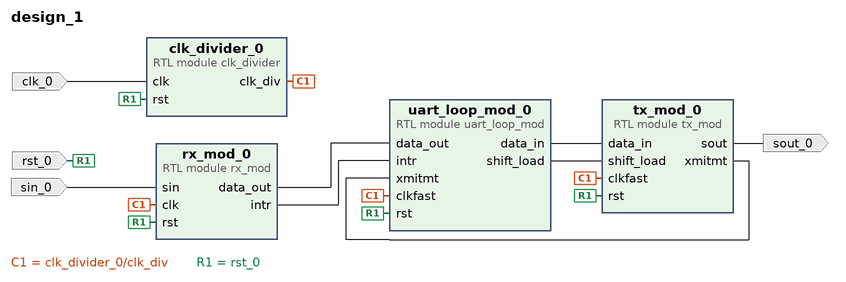
[diagram p0: block diagram of the top level]
# Vivado block design design_1, xc7z020clg400-1, Vivado 2018.3
create_bd_design design_1

create_bd_port -dir I -type rst rst_0
create_bd_port -dir I sin_0
create_bd_port -dir O sout_0
create_bd_port -dir I -type clk clk_0

create_bd_cell -type module -reference clk_divider clk_divider_0
create_bd_cell -type module -reference rx_mod rx_mod_0
create_bd_cell -type module -reference tx_mod tx_mod_0
create_bd_cell -type module -reference uart_loop_mod uart_loop_mod_0

# ---- connections ----

connect_bd_net [get_bd_pins clk_divider_0/clk_div] [get_bd_pins tx_mod_0/clkfast] [get_bd_pins uart_loop_mod_0/clkfast] [get_bd_pins rx_mod_0/clk]
connect_bd_net -net rst_0_1 [get_bd_ports rst_0] \
  [get_bd_pins clk_divider_0/rst] [get_bd_pins rx_mod_0/rst] [get_bd_pins tx_mod_0/rst] [get_bd_pins uart_loop_mod_0/rst]
connect_bd_net -net sin_0_1 [get_bd_ports sin_0] [get_bd_pins rx_mod_0/sin]
connect_bd_net [get_bd_pins tx_mod_0/sout] [get_bd_ports sout_0]
connect_bd_net [get_bd_pins rx_mod_0/data_out] [get_bd_pins uart_loop_mod_0/data_out]
connect_bd_net [get_bd_pins rx_mod_0/intr] [get_bd_pins uart_loop_mod_0/intr]
connect_bd_net [get_bd_pins uart_loop_mod_0/data_in] [get_bd_pins tx_mod_0/data_in]
connect_bd_net [get_bd_pins uart_loop_mod_0/shift_load] [get_bd_pins tx_mod_0/shift_load]
connect_bd_net [get_bd_pins tx_mod_0/xmitmt] [get_bd_pins uart_loop_mod_0/xmitmt]
connect_bd_net -net clk_0_1 [get_bd_ports clk_0] [get_bd_pins clk_divider_0/clk]

validate_bd_design
save_bd_design
